# EAGLE schematic Mainboard (EAGLE 8.7.1)

## Sheet 1 of 4: Avionics
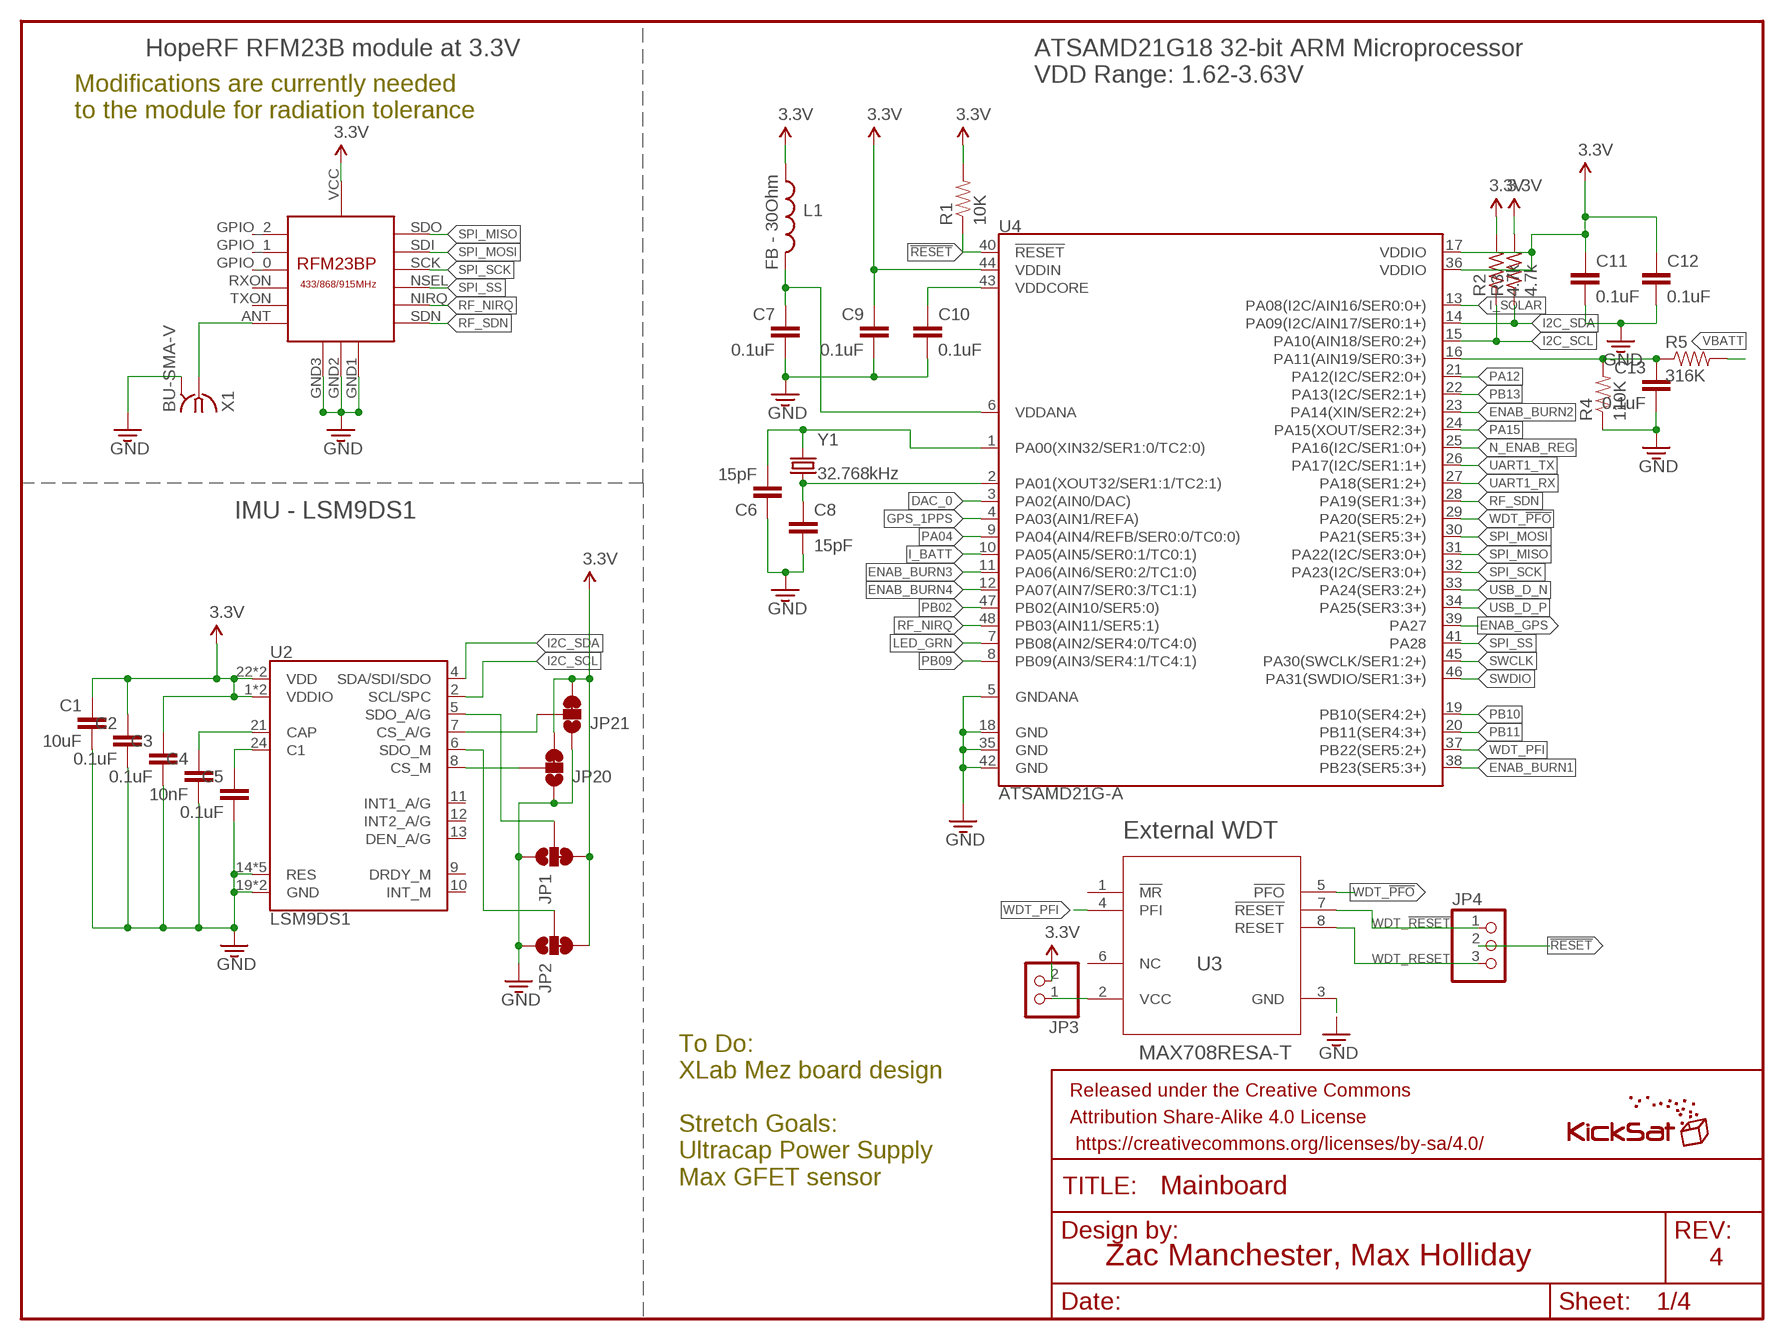
[diagram p0: schematic, sheet 1]

### Parts
C1  10uF  10UF-6.3V-20%(0603)  [0603-CAP]
C2  0.1uF  0.1UF-25V(+80/-20%)(0603)  [0603-CAP]
C3  0.1uF  0.1UF-25V(+80/-20%)(0603)  [0603-CAP]
C4  10nF  10NF/10000PF-50V-10%(0603)  [0603-CAP]
C5  0.1uF  0.1UF-25V(+80/-20%)(0603)  [0603-CAP]
C6  15pF  15PF-50V-5%(0603)  [0603-CAP@1]
C7  0.1uF  0.1UF-25V(+80/-20%)(0603)  [0603-CAP]
C8  15pF  15PF-50V-5%(0603)  [0603-CAP@1]
C9  0.1uF  0.1UF-25V(+80/-20%)(0603)  [0603-CAP]
C10  0.1uF  0.1UF-25V(+80/-20%)(0603)  [0603-CAP]
C11  0.1uF  0.1UF-25V(+80/-20%)(0603)  [0603-CAP]
C12  0.1uF  0.1UF-25V(+80/-20%)(0603)  [0603-CAP]
C13  0.1uF  0.1UF-25V(+80/-20%)(0603)  [0603-CAP]
FRAME1  FRAME-LETTER  [CREATIVE_COMMONS]
JP1  JUMPER-PAD-3-2OF3_NC_BY_TRACE_SMALL  [PAD-JUMPER-3-2OF3_NC_BY_TRACE_YES_SILK_FULL_BOX]
JP2  JUMPER-PAD-3-2OF3_NC_BY_TRACE_SMALL  [PAD-JUMPER-3-2OF3_NC_BY_TRACE_YES_SILK_FULL_BOX]
JP3  PINHD-1X2  [1X02]
JP4  PINHD-1X3  [1X03]
JP20  JUMPER-PAD-3-2OF3_NC_BY_TRACE_SMALL  [PAD-JUMPER-3-2OF3_NC_BY_TRACE_YES_SILK_FULL_BOX]
JP21  JUMPER-PAD-3-2OF3_NC_BY_TRACE_SMALL  [PAD-JUMPER-3-2OF3_NC_BY_TRACE_YES_SILK_FULL_BOX]
L1  FB - 30Ohm  INDUCTOR0603  [0603]
L2  KICKSAT_LOGO  [KICKSAT_LOGO]
R1  10K  10KOHM-1/10W-1%(0603)0603  [0603-RES]
R2  4.7k  R-US_R0603  [R0603]
R3  4.7k  R-US_R0603  [R0603]
R4  110K  10KOHM-1/10W-1%(0603)0603  [0603-RES]
R5  316K  10KOHM-1/10W-1%(0603)0603  [0603-RES]
U1  RFM23BP  [RFM23BP]
U2  LSM9DS1  [LGA24-8X4]
U3  MAX708RESA-T  [SO8]
U4  ATSAMD21G-A  [TQFP-48]
X1  BU-SMA-V  [BU-SMA-V]
Y1  32.768kHz  CRYSTAL3.2X1.5MM  [CRYSTAL-SMD-3.2X1.5MM]

### Nets
3.3V: C1.1 C2.1 C3.1 C9.1 C11.1 C12.1 JP1.3 JP2.3 JP3.2 JP20.3 JP21.3 L1.1 R1.2 R2.2 R3.2 U1.VCC U2.1(VDDIO) U2.3(VDDIO) U2.22(VDD) U2.23(VDD) U4.17(VDDIO) U4.36(VDDIO) U4.44(VDDIN) ; also sheet 2,3,4
!RESET: JP4.2 R1.1 U4.40(!RESET!) ; also sheet 3
DAC_0: U4.3(PA02(AIN0/DAC)) ; also sheet 4
ENAB_BURN1: U4.38(PB23(SER5:3+)) ; also sheet 3
ENAB_BURN2: U4.23(PA14(XIN/SER2:2+)) ; also sheet 3
ENAB_BURN3: U4.11(PA06(AIN6/SER0:2/TC1:0)) ; also sheet 3
ENAB_BURN4: U4.12(PA07(AIN7/SER0:3/TC1:1)) ; also sheet 3
ENAB_GPS: U4.39(PA27) ; also sheet 2
GND: C1.2 C2.2 C3.2 C4.2 C5.2 C6.1 C7.2 C8.2 C9.2 C10.2 C11.2 C12.2 C13.2 JP1.1 JP2.1 JP20.1 JP21.1 R4.1 U1.GND1 U1.GND2 U1.GND3 U2.14(RES) U2.15(RES) U2.16(RES) U2.17(RES) U2.18(RES) U2.19(GND) U2.20(GND) U3.3(GND) U4.5(GNDANA) U4.18(GND) U4.35(GND) U4.42(GND) X1.2 X1.3 X1.4 X1.5 ; also sheet 2,3,4
GPS_1PPS: U4.4(PA03(AIN1/REFA)) ; also sheet 4
I2C_SCL: R2.1 U2.2(SCL/SPC) U4.15(PA10(AIN18/SER0:2+)) ; also sheet 4
I2C_SDA: R3.1 U2.4(SDA/SDI/SDO) U4.14(PA09(I2C/AIN17/SER0:1+)) ; also sheet 4
I2C_SDOA/G: JP1.2 U2.5(SDO_A/G)
I_BATT: U4.10(PA05(AIN5/SER0:1/TC0:1)) ; also sheet 2
I_SOLAR: U4.13(PA08(I2C/AIN16/SER0:0+)) ; also sheet 2
LED_GRN: U4.7(PB08(AIN2/SER4:0/TC4:0)) ; also sheet 4
N$2: C4.1 U2.21(CAP)
N$6: C5.1 U2.24(C1)
N$8: JP3.1 U3.2(VCC)
N$18: C7.1 L1.2 U4.6(VDDANA)
N$19: U1.ANT X1.1
N$21: JP2.2 U2.6(SDO_M)
N$23: JP20.2 U2.8(CS_M)
N$26: JP21.2 U2.7(CS_A/G)
N$28: C6.2 U4.1(PA00(XIN32/SER1:0/TC2:0)) Y1.P$2
N$29: C8.1 U4.2(PA01(XOUT32/SER1:1/TC2:1)) Y1.P$1
N$40: C13.1 R4.2 R5.1 U4.16(PA11(AIN19/SER0:3+))
N_ENAB_REG: U4.25(PA16(I2C/SER1:0+)) ; also sheet 2
PA04: U4.9(PA04(AIN4/REFB/SER0:0/TC0:0))
PA12: U4.21(PA12(I2C/SER2:0+)) ; also sheet 4
PA15: U4.24(PA15(XOUT/SER2:3+))
PB02: U4.47(PB02(AIN10/SER5:0)) ; also sheet 4
PB09: U4.8(PB09(AIN3/SER4:1/TC4:1)) ; also sheet 4
PB10: U4.19(PB10(SER4:2+)) ; also sheet 4
PB11: U4.20(PB11(SER4:3+)) ; also sheet 4
PB13: U4.22(PA13(I2C/SER2:1+))
RF_NIRQ: U1.NIRQ U4.48(PB03(AIN11/SER5:1))
RF_SDN: U1.SDN U4.28(PA19(SER1:3+))
SPI_MISO: U1.SDO U4.31(PA22(I2C/SER3:0+)) ; also sheet 4
SPI_MOSI: U1.SDI U4.30(PA21(SER5:3+))
SPI_SCK: U1.SCK U4.32(PA23(I2C/SER3:0+)) ; also sheet 4
SPI_SS: U1.NSEL U4.41(PA28)
SWCLK: U4.45(PA30(SWCLK/SER1:2+)) ; also sheet 3
SWDIO: U4.46(PA31(SWDIO/SER1:3+)) ; also sheet 3
UART1_RX: U4.27(PA18(SER1:2+)) ; also sheet 4
UART1_TX: U4.26(PA17(I2C/SER1:1+)) ; also sheet 4
USB_D_N: U4.33(PA24(SER3:2+)) ; also sheet 3
USB_D_P: U4.34(PA25(SER3:3+)) ; also sheet 3
VBATT: R5.2 ; also sheet 2,3
VDDCORE3: C10.1 U4.43(VDDCORE)
WDT_!PFO: U3.5(!PFO) U4.29(PA20(SER5:2+))
WDT_!RESET: JP4.1 U3.7(!RESET)
WDT_PFI: U3.4(PFI) U4.37(PB22(SER5:2+))
WDT_RESET: JP4.3 U3.8(RESET)
Unconnected: U1.GPIO_0 U1.GPIO_1 U1.GPIO_2 U1.RXON U1.TXON U2.9(DRDY_M) U2.10(INT_M) U2.11(INT1_A/G) U2.12(INT2_A/G) U2.13(DEN_A/G) U3.1(!MR) U3.6(NC)

### Notes on the sheet
- HopeRF RFM23B module at 3.3V
- ATSAMD21G18 32-bit ARM Microprocessor 
  VDD Range: 1.62-3.63V
- Modifications are currently needed
  to the module for radiation tolerance
- IMU - LSM9DS1
- External WDT
- To Do:
  XLab Mez board design
  
  Stretch Goals:
  Ultracap Power Supply
  Max GFET sensor
- Zac Manchester, Max Holliday | 4

## Sheet 2 of 4: Power
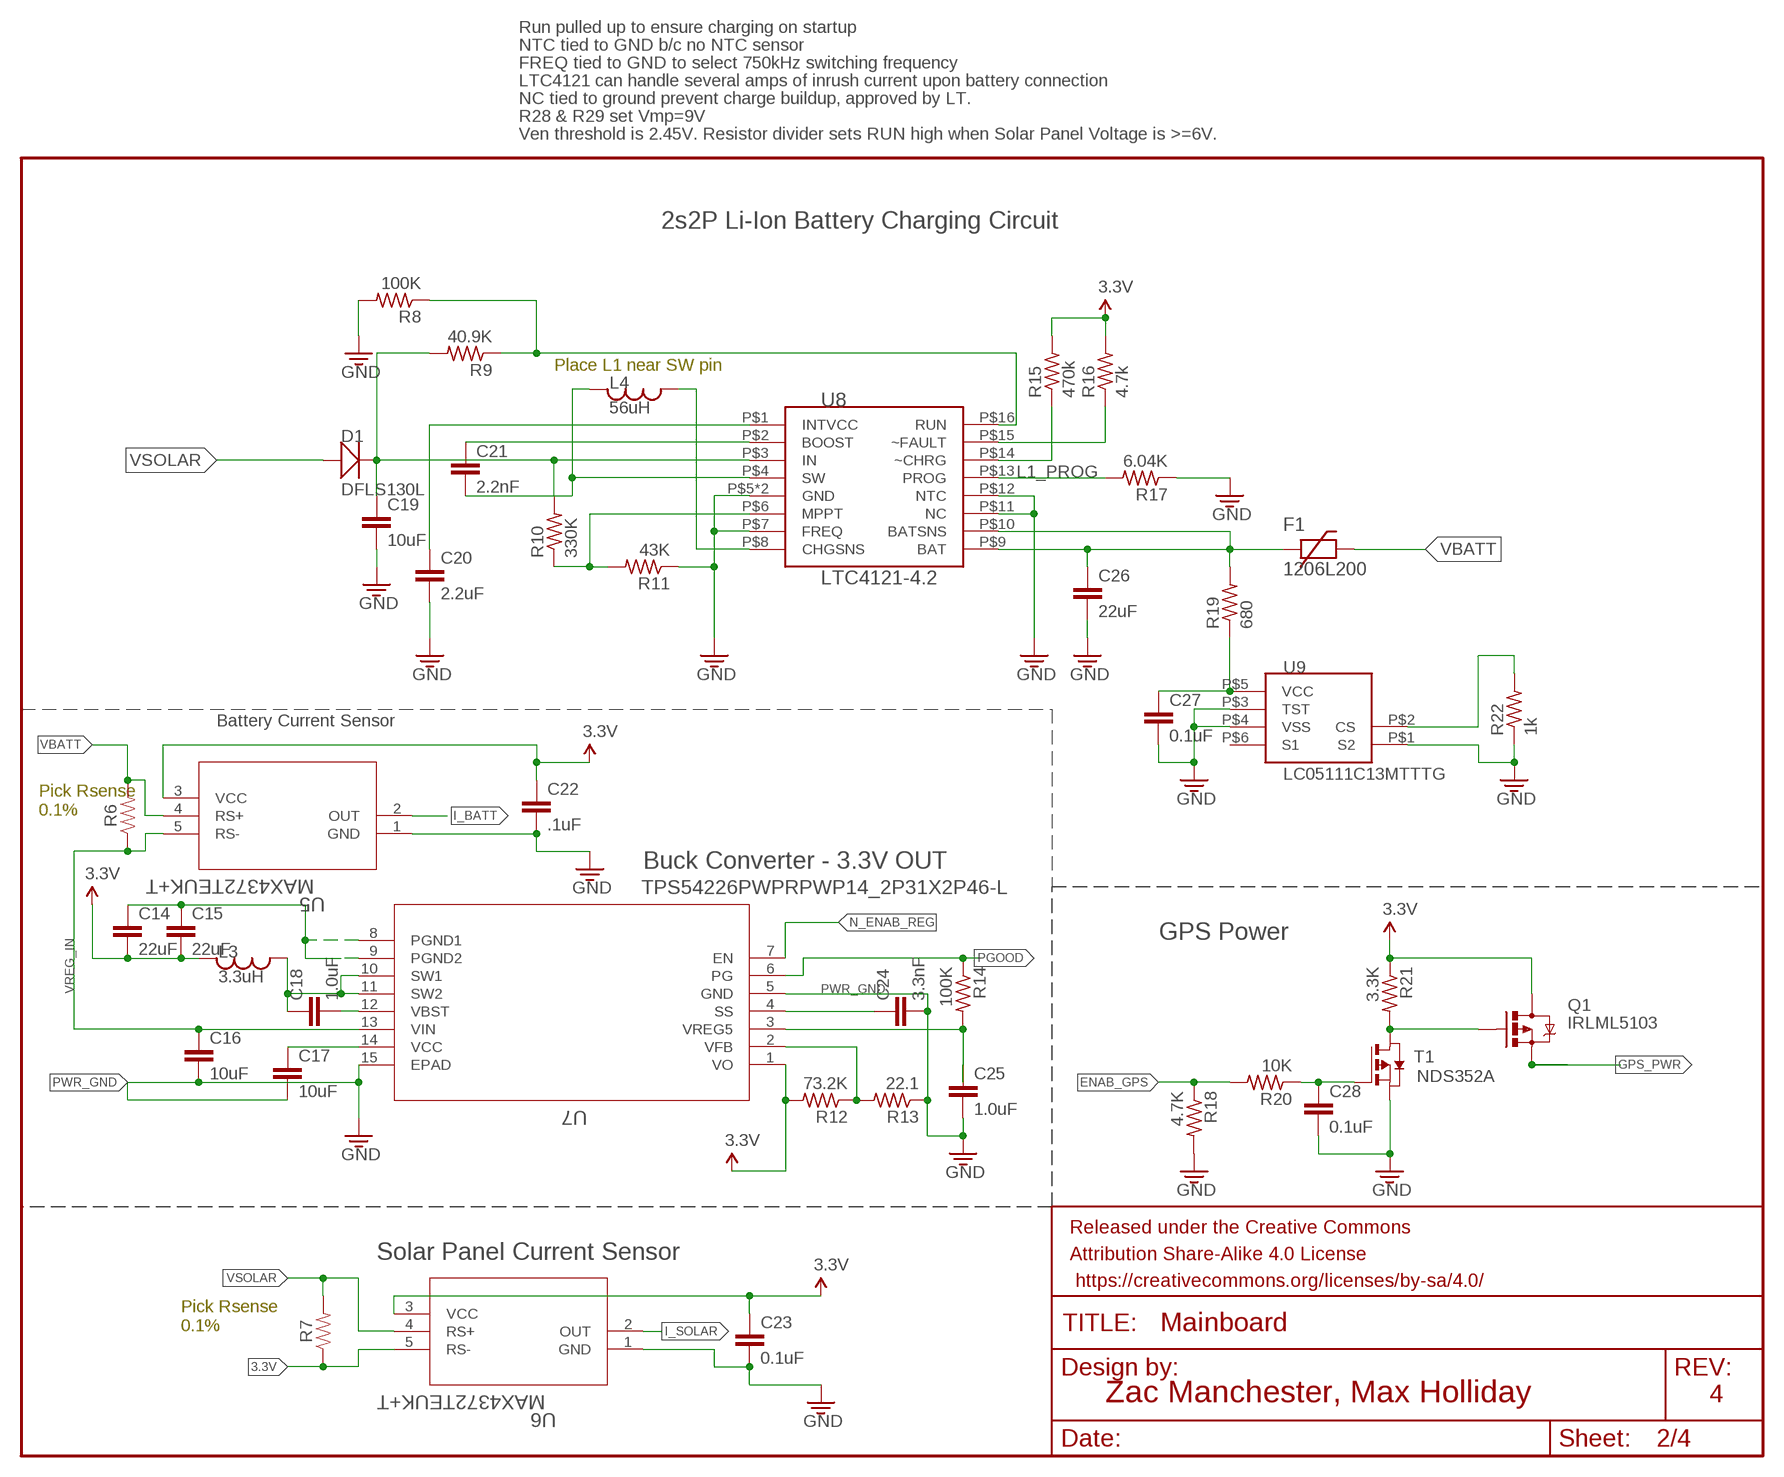
[diagram p1: schematic, sheet 2]

### Parts
C14  22uF  22UF-0805-6.3V-20%  [0805]
C15  22uF  22UF-0805-6.3V-20%  [0805]
C16  10uF  10UF-0603-6.3V-20%  [0603]
C17  10uF  10UF-0603-6.3V-20%  [0603]
C18  1.0uF  1.0UF-0603-16V-10%  [0603]
C19  10uF  10UF-0603-6.3V-20%  [0603]
C20  2.2uF  2.2UF-0603-10V-20%  [0603]
C21  2.2nF  2.2NF/2200PF-0603-50V-10%  [0603]
C22  .1uF  CAP0603-CAP  [0603-CAP@1]
C23  0.1uF  0.1UF-0603-25V-5%  [0603]
C24  3.3nF  3.3NF-0603-100V-10%  [0603]
C25  1.0uF  1.0UF-0603-16V-10%  [0603]
C26  22uF  0.1UF-0603-25V-5%  [0603]
C27  0.1uF  0.1UF-0603-25V-5%  [0603]
C28  0.1uF  0.1UF-0603-25V-5%  [0603]
D1  DFLS130L  [PWRDI-123]
F1  1206L200  PTCFUSE1206  [1206]
FRAME2  FRAME-LETTER  [CREATIVE_COMMONS]
L3  3.3uH  IND1812  [1812]
L4  56uH  IND1812  [1812]
Q1  IRLML5103  MOSFET-PCHANNEL  [SOT23-3]
R6  RESISTOR0603  [0603]
R7  RESISTOR0603  [0603]
R8  100K  R-US_R0603  [R0603]
R9  40.9K  R-US_R0603  [R0603]
R10  330K  R-US_R0603  [R0603]
R11  43K  R-US_R0603  [R0603]
R12  73.2K  R-US_R0603  [R0603]
R13  22.1  R-US_R0603  [R0603]
R14  100K  R-US_R0603  [R0603]
R15  470k  R-US_R0603  [R0603]
R16  4.7k  R-US_R0603  [R0603]
R17  6.04K  R-US_R0603  [R0603]
R18  4.7K  R-US_R0603  [R0603]
R19  680  R-US_R0603  [R0603]
R20  10K  R-US_R0603  [R0603]
R21  3.3K  R-US_R0603  [R0603]
R22  1k  R-US_R0603  [R0603]
T1  NDS352A  PMOSSOT23  [SOT-23]
U5  MAX4372TEUK+T  [21-0057F]
U6  MAX4372TEUK+T  [21-0057F]
U7  TPS54226PWPRPWP14_2P31X2P46-L  [PWP14_2P31X2P46-L]
U8  LTC4121-4.2  [QFN-16-PAD]
U9  LC05111C13MTTTG  [WDFN6]

### Nets
3.3V: C14.2 C15.2 C22.1 C23.1 L3.P$1 Q1.3(D) R7.1 R12.2 R15.2 R16.2 R21.1 U5.3(VCC) U6.3(VCC) U6.5(RS-) U7.1(VO) ; also sheet 1,3,4
ENAB_GPS: R18.1 R20.2 ; also sheet 1
GND: C19.2 C20.2 C22.2 C23.2 C26.2 C27.2 C28.2 R8.2 R11.1 R17.1 R18.2 R22.1 T1.2(S) U5.1(GND) U6.1(GND) U8.P$5(GND) U8.P$7(FREQ) U8.P$11(NC) U8.P$12(NTC) U8.P$17(GND) U9.P$1(S2) U9.P$3(TST) U9.P$4(VSS) ; also sheet 1,3,4
GPS_PWR: Q1.2(S) ; also sheet 4
I_BATT: U5.2(OUT) ; also sheet 1
I_SOLAR: U6.2(OUT) ; also sheet 1
L1_CHG: R8.1 R9.1 U8.P$16(RUN)
L1_FAULTN: R16.1 U8.P$15(~FAULT)
L1_PROG: R17.2 U8.P$13(PROG)
LION1: C26.1 F1.1 R19.2 U8.P$9(BAT) U8.P$10(BATSNS)
N$3: C18.1 L3.P$2 U7.10(SW1) U7.11(SW2)
N$10: C28.1 R20.1 T1.3(G)
N$12: Q1.1(G) R21.2 T1.1(D)
N$14: C18.2 U7.12(VBST)
N$32: C21.2 L4.P$1 U8.P$4(SW)
N$33: C21.1 U8.P$2(BOOST)
N$34: C20.1 U8.P$1(INTVCC)
N$35: R10.1 R11.2 U8.P$6(MPPT)
N$36: L4.P$2 U8.P$8(CHGSNS)
N$37: R15.1 U8.P$14(~CHRG)
N$41: C27.1 R19.1 U9.P$5(VCC)
N$42: C17.1 U7.14(VCC)
N$45: R22.2 U9.P$2(CS)
N$46: C25.1 R14.2 U7.3(VREG5)
N$51: C24.1 U7.4(SS)
N$52: R12.1 R13.2 U7.2(VFB)
N_ENAB_REG: U7.7(EN) ; also sheet 1
PGOOD: R14.1 U7.6(PG)
PWR_GND: C14.1 C15.1 C16.2 C17.2 C24.2 C25.2 R13.1 U7.5(GND) U7.8(PGND1) U7.9(PGND2) U7.15(EPAD) ; supply symbol labelled GND
VBATT: F1.2 R6.2 U5.4(RS+) ; also sheet 1,3
VREG_IN: C16.1 R6.1 U5.5(RS-) U7.13(VIN)
VSOLAR: D1.A R7.2 U6.4(RS+) ; also sheet 3
VSOLAR_IN: C19.1 D1.C R9.2 R10.2 U8.P$3(IN)
Unconnected: U9.P$6(S1)

### Notes on the sheet
- Run pulled up to ensure charging on startup
- NTC tied to GND b/c no NTC sensor
- FREQ tied to GND to select 750kHz switching frequency
- LTC4121 can handle several amps of inrush current upon battery connection
- NC tied to ground prevent charge buildup, approved by LT.
- R28 & R29 set Vmp=9V
- Ven threshold is 2.45V. Resistor divider sets RUN high when Solar Panel Voltage is >=6V.
- 2s2P Li-Ion Battery Charging Circuit
- Place L1 near SW pin
- Battery Current Sensor
- Pick Rsense
  0.1%
- Buck Converter - 3.3V OUT
- GPS Power
- Solar Panel Current Sensor
- Pick Rsense
  0.1%
- Zac Manchester, Max Holliday | 4

## Sheet 3 of 4: Connectors
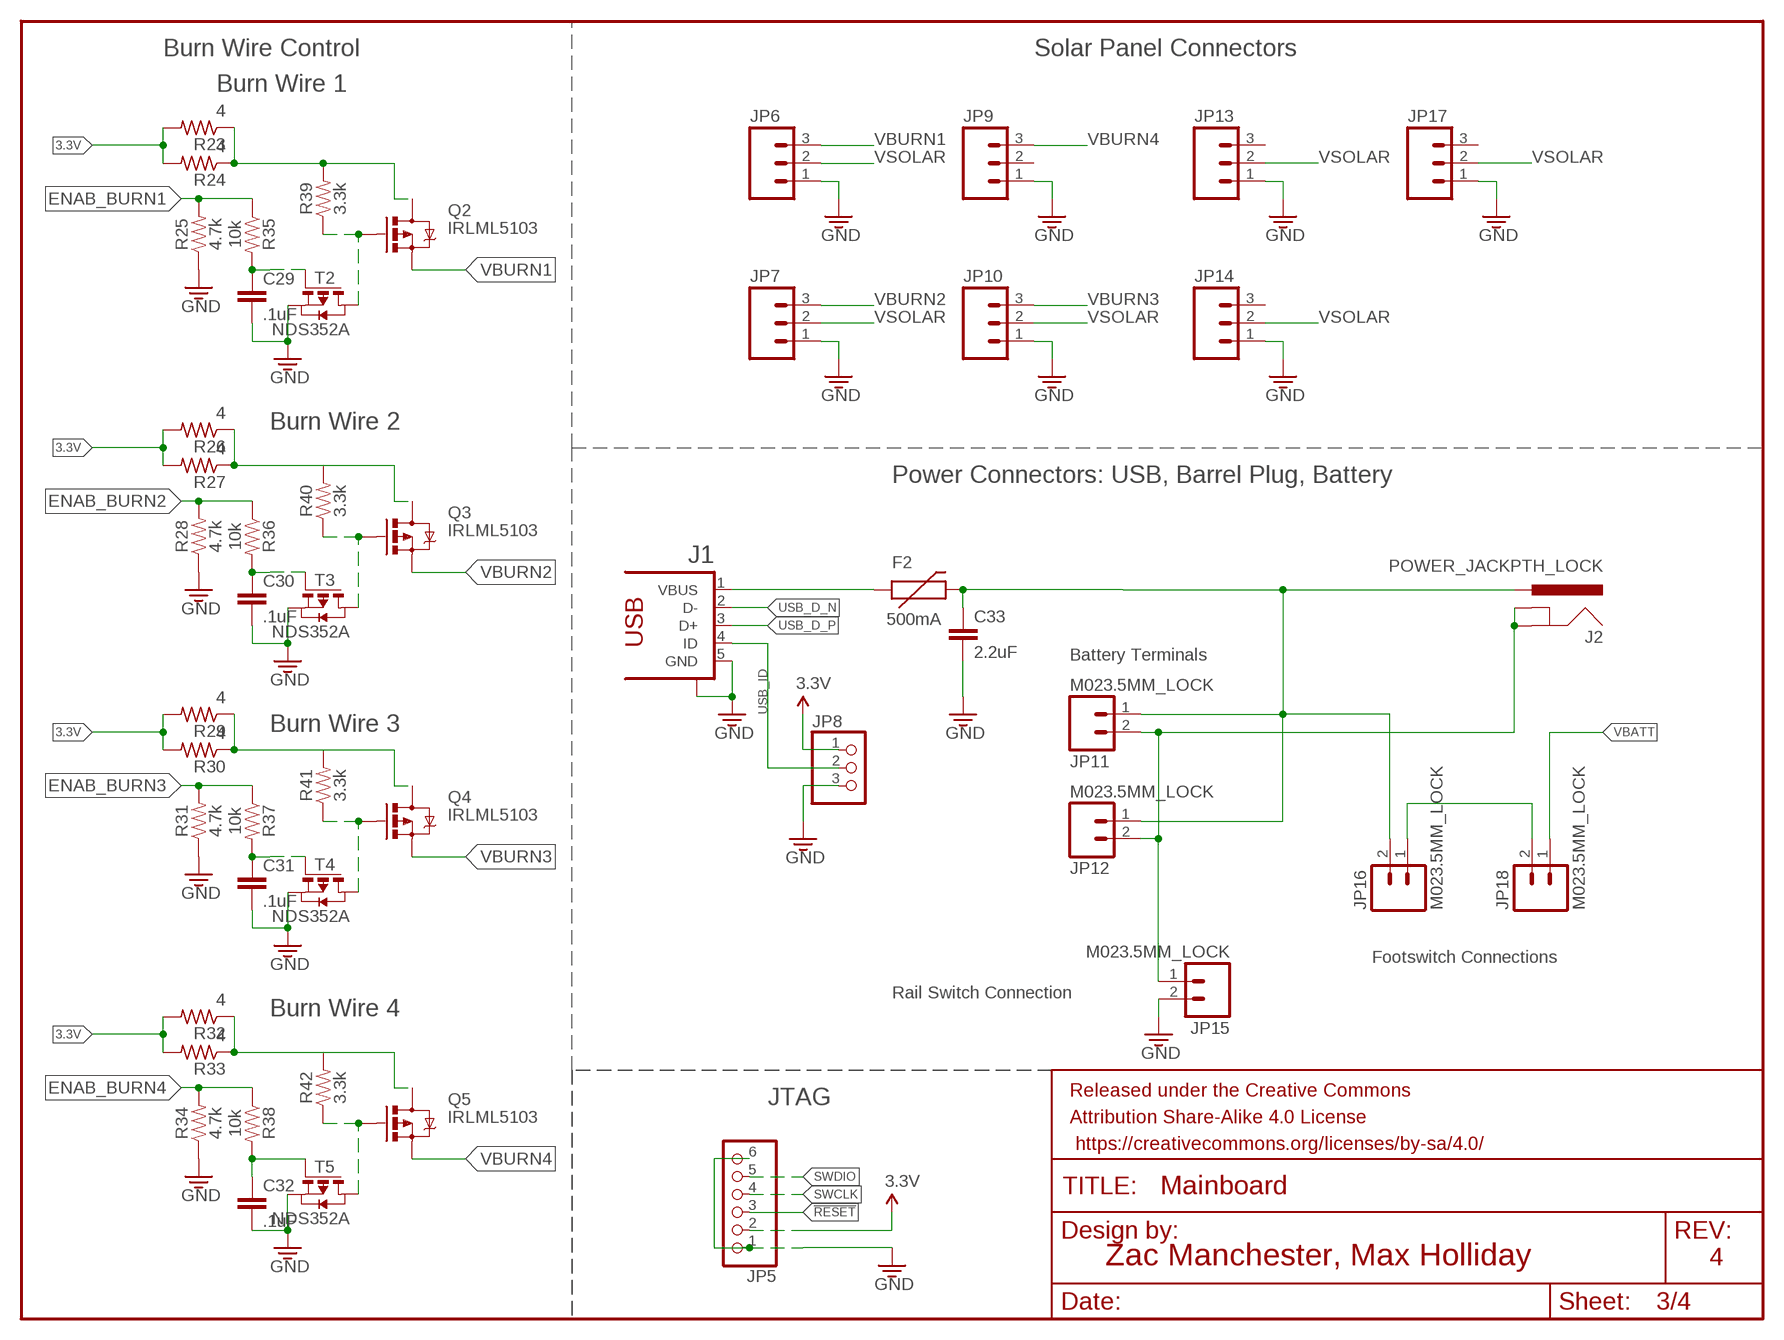
[diagram p2: schematic, sheet 3]

### Parts
C29  .1uF  CAP0603-CAP  [0603-CAP@1]
C30  .1uF  CAP0603-CAP  [0603-CAP@1]
C31  .1uF  CAP0603-CAP  [0603-CAP@1]
C32  .1uF  CAP0603-CAP  [0603-CAP@1]
C33  2.2uF  2.2UF-0603-10V-20%  [0603]
F2  500mA  PTCSMD  [PTC-1206]
FRAME3  FRAME-LETTER  [CREATIVE_COMMONS]
J1  1981584-1  [1981584-1]
J2  POWER_JACKPTH_LOCK  [POWER_JACK_PTH_LOCK]
JP5  PINHD-1X6  [1X06]
JP6  M03POLAR_LOCK  [MOLEX-1X3_LOCK]
JP7  M03POLAR_LOCK  [MOLEX-1X3_LOCK]
JP8  PINHD-1X3  [1X03]
JP9  M03POLAR_LOCK  [MOLEX-1X3_LOCK]
JP10  M03POLAR_LOCK  [MOLEX-1X3_LOCK]
JP11  M023.5MM_LOCK  [SCREWTERMINAL-3.5MM-2_LOCK]
JP12  M023.5MM_LOCK  [SCREWTERMINAL-3.5MM-2_LOCK]
JP13  M03POLAR_LOCK  [MOLEX-1X3_LOCK]
JP14  M03POLAR_LOCK  [MOLEX-1X3_LOCK]
JP15  M023.5MM_LOCK  [SCREWTERMINAL-3.5MM-2_LOCK]
JP16  M023.5MM_LOCK  [SCREWTERMINAL-3.5MM-2_LOCK]
JP17  M03POLAR_LOCK  [MOLEX-1X3_LOCK]
JP18  M023.5MM_LOCK  [SCREWTERMINAL-3.5MM-2_LOCK]
Q2  IRLML5103  MOSFET-PCHANNEL  [SOT23-3]
Q3  IRLML5103  MOSFET-PCHANNEL  [SOT23-3]
Q4  IRLML5103  MOSFET-PCHANNEL  [SOT23-3]
Q5  IRLML5103  MOSFET-PCHANNEL  [SOT23-3]
R23  4  R-US_R0603  [R0603]
R24  4  R-US_R0603  [R0603]
R25  4.7k  RESISTOR0603  [0603]
R26  4  R-US_R0603  [R0603]
R27  4  R-US_R0603  [R0603]
R28  4.7k  RESISTOR0603  [0603]
R29  4  R-US_R0603  [R0603]
R30  4  R-US_R0603  [R0603]
R31  4.7k  RESISTOR0603  [0603]
R32  4  R-US_R0603  [R0603]
R33  4  R-US_R0603  [R0603]
R34  4.7k  RESISTOR0603  [0603]
R35  10k  RESISTOR0603  [0603]
R36  10k  RESISTOR0603  [0603]
R37  10k  RESISTOR0603  [0603]
R38  10k  RESISTOR0603  [0603]
R39  3.3k  RESISTOR0603  [0603]
R40  3.3k  RESISTOR0603  [0603]
R41  3.3k  RESISTOR0603  [0603]
R42  3.3k  RESISTOR0603  [0603]
T2  NDS352A  PMOSSOT23  [SOT-23]
T3  NDS352A  PMOSSOT23  [SOT-23]
T4  NDS352A  PMOSSOT23  [SOT-23]
T5  NDS352A  PMOSSOT23  [SOT-23]

### Nets
3.3V: JP5.2 JP8.1 R23.2 R24.2 R26.2 R27.2 R29.2 R30.2 R32.2 R33.2 ; also sheet 1,2,4
!RESET: JP5.3 ; also sheet 1
ENAB_BURN1: R25.2 R35.1 ; also sheet 1
ENAB_BURN2: R28.2 R36.1 ; also sheet 1
ENAB_BURN3: R31.2 R37.1 ; also sheet 1
ENAB_BURN4: R34.2 R38.1 ; also sheet 1
GND: C29.2 C30.2 C31.2 C32.2 C33.2 J1.5(GND) J1.S1 JP5.1 JP5.6 JP6.1 JP7.1 JP8.3 JP9.1 JP10.1 JP13.1 JP14.1 JP15.2 JP17.1 R25.1 R28.1 R31.1 R34.1 T2.2(S) T3.2(S) T4.2(S) T5.2(S) ; also sheet 1,2,4
N$4: JP16.1 JP18.2
N$5: C30.1 R36.2 T3.3(G)
N$7: Q2.1(G) R39.1 T2.1(D)
N$11: C31.1 R37.2 T4.3(G)
N$13: F2.1 J1.1(VBUS)
N$15: Q3.1(G) R40.1 T3.1(D)
N$22: J2.GND J2.GNDBREAK JP11.2 JP12.2 JP15.1
N$25: C29.1 R35.2 T2.3(G)
N$38: C32.1 R38.2 T5.3(G)
N$44: Q4.1(G) R41.1 T4.1(D)
N$47: Q5.1(G) R42.1 T5.1(D)
SWCLK: JP5.4 ; also sheet 1
SWDIO: JP5.5 ; also sheet 1
USB_D_N: J1.2(D-) ; also sheet 1
USB_D_P: J1.3(D+) ; also sheet 1
USB_ID: J1.4(ID) JP8.2
VBATT: C33.1 F2.2 J2.PWR JP11.1 JP12.1 JP16.2 JP18.1 ; also sheet 1,2
VBURN1: JP6.3 Q2.2(S)
VBURN2: JP7.3 Q3.2(S)
VBURN3: JP10.3 Q4.2(S)
VBURN4: JP9.3 Q5.2(S)
VBURN_IN: Q2.3(D) Q3.3(D) Q4.3(D) Q5.3(D) R23.1 R24.1 R26.1 R27.1 R29.1 R30.1 R32.1 R33.1 R39.2 R40.2 R41.2 R42.2
VSOLAR: JP6.2 JP7.2 JP10.2 JP13.2 JP14.2 JP17.2 ; also sheet 2
Unconnected: JP9.2 JP13.3 JP14.3 JP17.3

### Notes on the sheet
- Burn Wire Control | Solar Panel Connectors
- Burn Wire 1
- Burn Wire 2
- Power Connectors: USB, Barrel Plug, Battery
- Battery Terminals
- Burn Wire 3
- Footswitch Connections
- Rail Switch Connection
- Burn Wire 4
- JTAG
- Zac Manchester, Max Holliday | 4

## Sheet 4 of 4: RF and GPS
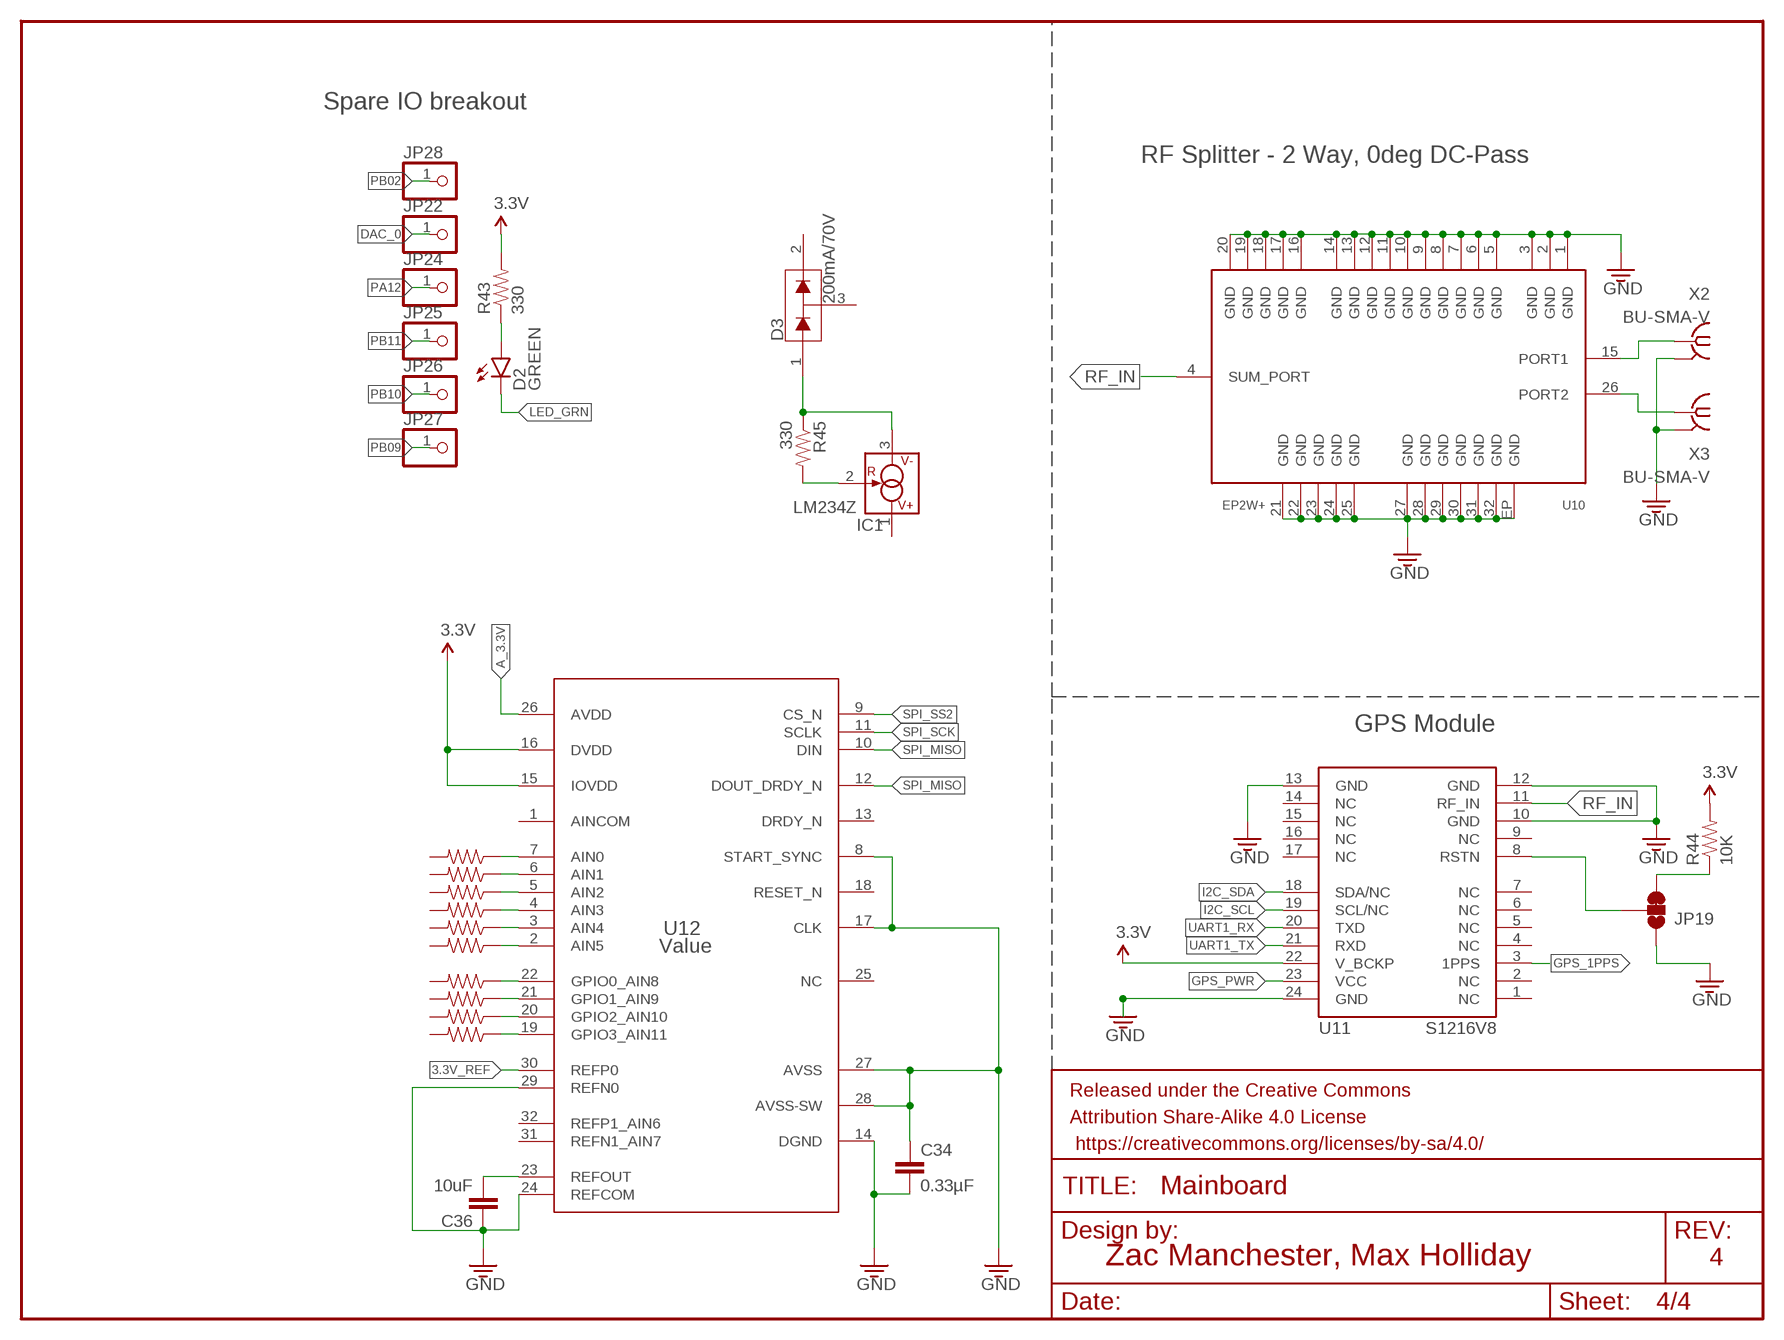
[diagram p3: schematic, sheet 4]

### Parts
C34  0.33µF  0.33UF/330NF-0805-50V-10%  [0805]
C36  10uF  10UF-0603-6.3V-20%  [0603]
D2  GREEN  LED-GREEN0603  [LED-0603]
D3  200mA/70V  BAV99  [SOT23-3]
FRAME4  FRAME-LETTER  [CREATIVE_COMMONS]
IC1  LM234Z  [TO92]
JP19  JUMPER-PAD-3-2OF3_NC_BY_TRACE_SMALL  [PAD-JUMPER-3-2OF3_NC_BY_TRACE_YES_SILK_FULL_BOX]
JP22  PINHD-1X1  [1X01]
JP24  PINHD-1X1  [1X01]
JP25  PINHD-1X1  [1X01]
JP26  PINHD-1X1  [1X01]
JP27  PINHD-1X1  [1X01]
JP28  PINHD-1X1  [1X01]
R43  330  330OHM1/10W1%(0603)  [0603-RES]
R44  10K  10KOHM-1/10W-1%(0603)0603  [0603-RES]
R45  330  330OHM1/10W1%(0603)  [0603-RES]
R46  10K  10KOHM-1/10W-1%(0603)0603  [0603-RES]
R47  10K  10KOHM-1/10W-1%(0603)0603  [0603-RES]
R48  10K  10KOHM-1/10W-1%(0603)0603  [0603-RES]
R49  10K  10KOHM-1/10W-1%(0603)0603  [0603-RES]
R50  10K  10KOHM-1/10W-1%(0603)0603  [0603-RES]
R51  10K  10KOHM-1/10W-1%(0603)0603  [0603-RES]
R52  10K  10KOHM-1/10W-1%(0603)0603  [0603-RES]
R53  10K  10KOHM-1/10W-1%(0603)0603  [0603-RES]
R54  10K  10KOHM-1/10W-1%(0603)0603  [0603-RES]
R55  10K  10KOHM-1/10W-1%(0603)0603  [0603-RES]
U10  EP2W+  [QFN32-5X5MM]
U11  S1216V8  [S1216_24PIN_PACKAGE]
U12  Value  ADS124S08IPBSR  [PBS0032A_N]
X2  BU-SMA-V  [BU-SMA-V]
X3  BU-SMA-V  [BU-SMA-V]

### Nets
3.3V: R43.2 R44.2 U11.22(V_BCKP) U12.15(IOVDD) U12.16(DVDD) ; also sheet 1,2,3
3.3V_REF: U12.30(REFP0)
A_3.3V: U12.26(AVDD)
DAC_0: JP22.1 ; also sheet 1
GND: C34.1 C34.2 C36.1 JP19.1 U10.1(GND) U10.2(GND) U10.3(GND) U10.5(GND) U10.6(GND) U10.7(GND) U10.8(GND) U10.9(GND) U10.10(GND) U10.11(GND) U10.12(GND) U10.13(GND) U10.14(GND) U10.16(GND) U10.17(GND) U10.18(GND) U10.19(GND) U10.20(GND) U10.21(GND) U10.22(GND) U10.23(GND) U10.24(GND) U10.25(GND) U10.27(GND) U10.28(GND) U10.29(GND) U10.30(GND) U10.31(GND) U10.32(GND) U10.EP(GND) U11.10(GND) U11.12(GND) U11.13(GND) U11.24(GND) U12.8(START_SYNC) U12.14(DGND) U12.17(CLK) U12.24(REFCOM) U12.27(AVSS) U12.28(AVSS-SW) U12.29(REFN0) X2.2 X2.3 X2.4 X2.5 X3.2 X3.3 X3.4 X3.5 ; also sheet 1,2,3
GPS_1PPS: U11.3(1PPS) ; also sheet 1
GPS_PWR: U11.23(VCC) ; also sheet 2
I2C_SCL: U11.19(SCL/NC) ; also sheet 1
I2C_SDA: U11.18(SDA/NC) ; also sheet 1
LED_GRN: D2.C ; also sheet 1
N$1: D2.A R43.1
N$9: JP19.2 U11.8(RSTN)
N$16: U10.15(PORT1) X2.1
N$17: U10.26(PORT2) X3.1
N$20: R47.1 U12.7(AIN0)
N$24: JP19.3 R44.1
N$27: R48.1 U12.6(AIN1)
N$30: R49.1 U12.5(AIN2)
N$31: IC1.2(R) R45.2
N$39: D3.1(A1) IC1.3(V-) R45.1
N$43: R50.1 U12.4(AIN3)
N$48: R51.1 U12.3(AIN4)
N$49: R52.1 U12.2(AIN5)
N$50: R46.1 U12.22(GPIO0_AIN8)
N$53: R53.1 U12.21(GPIO1_AIN9)
N$54: C36.2 U12.23(REFOUT)
N$55: R54.1 U12.20(GPIO2_AIN10)
N$56: R55.1 U12.19(GPIO3_AIN11)
PA12: JP24.1 ; also sheet 1
PB02: JP28.1 ; also sheet 1
PB09: JP27.1 ; also sheet 1
PB10: JP26.1 ; also sheet 1
PB11: JP25.1 ; also sheet 1
RF_IN: U10.4(SUM_PORT) U11.11(RF_IN)
SPI_MISO: U12.10(DIN) U12.12(DOUT_DRDY_N) ; also sheet 1
SPI_SCK: U12.11(SCLK) ; also sheet 1
SPI_SS2: U12.9(CS_N)
UART1_RX: U11.20(TXD) ; also sheet 1
UART1_TX: U11.21(RXD) ; also sheet 1
Unconnected: D3.2(C2) D3.3(COM) IC1.1(V+) R46.2 R47.2 R48.2 R49.2 R50.2 R51.2 R52.2 R53.2 R54.2 R55.2 U11.1(NC) U11.2(NC) U11.4(NC) U11.5(NC) U11.6(NC) U11.7(NC) U11.9(NC) U11.14(NC) U11.15(NC) U11.16(NC) U11.17(NC) U12.1(AINCOM) U12.13(DRDY_N) U12.18(RESET_N) U12.25(NC) U12.31(REFN1_AIN7) U12.32(REFP1_AIN6)

### Notes on the sheet
- Spare IO breakout
- RF Splitter - 2 Way, 0deg DC-Pass
- GPS Module
- Zac Manchester, Max Holliday | 4

## Library data of the parts
C1 = SparkFun-Capacitors:10UF-6.3V-20%(0603): CAP-11015; PROD_ID: CAP-11015
C2 C3 C5 C7 C9-C13 = SparkFun-Capacitors:0.1UF-25V(+80/-20%)(0603): CAP-00810 Ceramic Standard decoupling cap; PROD_ID: CAP-00810
C4 = SparkFun-Capacitors:10NF/10000PF-50V-10%(0603): CAP-00867; PROD_ID: CAP-00867
C6 C8 = SparkFun-Capacitors:15PF-50V-5%(0603): CAP-07881; PROD_ID: CAP-07881
C14 C15 = SparkFun-Capacitors:22UF: 22µF ceramic capacitors A capacitor is a passive two-terminal electrical component used to store electrical energy temporarily in an electric field.; PROD_ID: CAP-08402
C16 C17 C19 C36 = SparkFun-Capacitors:10UF: 10.0µF ceramic capacitors A capacitor is a passive two-terminal electrical component used to store electrical energy temporarily in an electric field.; PROD_ID: CAP-11015
C18 C25 = SparkFun-Capacitors:1.0UF: 1µF ceramic capacitors A capacitor is a passive two-terminal electrical component used to store electrical energy temporarily in an electric field.; PROD_ID: CAP-00868
C20 C33 = SparkFun-Capacitors:2.2UF: 2.2µF ceramic capacitors A capacitor is a passive two-terminal electrical component used to store electrical energy temporarily in an electric field.; PROD_ID: CAP-07888
C21 = SparkFun-Capacitors:2.2NF/2200PF: 2.2nF/2,200pF ceramic capacitors A capacitor is a passive two-terminal electrical component used to store electrical energy temporarily in an electric field.; PROD_ID: CAP-07877
C22 C29-C32 = SparkFun-Capacitors:CAP: Capacitor Standard 0603 ceramic capacitor, and 0.1" leaded capacitor.
C23 C27 C28 = SparkFun-Capacitors:0.1UF: 0.1µF ceramic capacitors A capacitor is a passive two-terminal electrical component used to store electrical energy temporarily in an electric field.; PROD_ID: CAP-08604
C24 = SparkFun-Capacitors:3.3NF: 3.3nF ceramic capacitors A capacitor is a passive two-terminal electrical component used to store electrical energy temporarily in an electric field.; PROD_ID: CAP-09633
C26 = SparkFun-Capacitors:0.1UF: 0.1µF ceramic capacitors A capacitor is a passive two-terminal electrical component used to store electrical energy temporarily in an electric field.; PROD_ID: CAP-08604; VALUE: 0.1uF
C34 = SparkFun-Capacitors:0.33UF/330NF: 0.33µF/330nF ceramic capacitors A capacitor is a passive two-terminal electrical component used to store electrical energy temporarily in an electric field.; PROD_ID: CAP-08469
D1 = BrownSpaceEngineering:DFLS130L
D2 = SparkFun-LED:LED-GREEN: Various green LEDs Green LEDs used in SFE Production 0603- DIO-00821 LARGE- DIO-00862 LILYPAD- DIO-09910; PROD_ID: DIO-00821
D3 = SparkFun-DiscreteSemi:BAV99: Series-pair diode array Two small signal silicon diodes connected anode to cathode. Connections to all three nodes available. Link to datasheet <https://www.fairchildsemi.com/datasheets/BA/BAV99.pdf> SparkFun Products: SparkFun AutoDriver <https://www.sparkfun.com/products/13752>; PROD_ID: DIO-10647
F1 = BrownSpaceEngineering:PTCFUSE: PTC Fuse
F2 = SparkFun-PowerIC:PTC: Resettable Fuse PTC Resettable Fuse. Spark Fun Electronics SKU : COM-08357; PROD_ID: RES-11150
FRAME1 FRAME2 FRAME4 = SparkFun-Aesthetics:FRAME-LETTER: Schematic Frame - Letter Standard 8.5x11 US Letter frame
FRAME3 = SparkFun-Aesthetics:FRAME-LETTER: Schematic Frame Standard 8.5x11 US Letter frame
IC1 = linear:LM*34: 3-Terminal Adjustable Current Sources Source: www.national.com/pf/LM/LM334.html | LM134.pdf
J1 = audio amplifier example:1981584-1: Receptacle, micro-USB, type A/B Tyco Electronics
J2 = SparkFun-Connectors:POWER_JACK: Power Jack Connector This is the standard 5.5mm barrel jack for power. The PTH is the most common, proven, reliable, footprint. The Slot footprint only works if the mill layer is transmitted to the PCB fab house so be warned. Here are the connectors we sell at SparkFun: DC Barrel Power Jack/Connector <https://www.sparkfun.com/products/119> (PRT-00119) DC Barrel Power Jack/Connector (SMD) <https://www.sparkfun.com/products/12748> (PRT-12748) DC Barrel Jack Adapter - Breadboard Compatible <https://www.sparkfun.com/products/10811> (PRT-10811) It is used on this SparkFun product (and many, many others): SparkFun RedBoard - Programmed with Arduino <https://www.sparkfun.com/products/12757> (DEV-12757) Also, if you need a mating power supply or connector, please check these out: Wall Adapter Power Supply - 9VDC 650mA <https://www.sparkfun.com/products/298> (TOL-00298) DC Barrel Jack Adapter - Male <https://www.sparkfun.com/products/10287> (PRT-10287); PROD_ID: CONN-08197; SF_ID: PRT-00119
JP1 JP2 JP19-JP21 = SparkFun-Passives:JUMPER-PAD-3-2OF3_NC_BY_TRACE
JP3 = pinhead:PINHD-1X2: PIN HEADER
JP4 JP8 = pinhead:PINHD-1X3: PIN HEADER
JP5 = pinhead:PINHD-1X6: PIN HEADER
JP6 JP7 JP9 JP10 JP13 JP14 JP17 = SparkFun-Connectors:M03: Header 3 Standard 3-pin 0.1" header. Use with straight break away headers (SKU : PRT-00116), right angle break away headers (PRT-00553), swiss pins (PRT-00743), machine pins (PRT-00117), and female headers (PRT-00115). Molex polarized connector foot print use with SKU : PRT-08232 with associated crimp pins and housings.
JP11 JP12 JP15 JP16 JP18 = SparkFun-Connectors:M02: Standard 2-pin 0.1" header. Use with - straight break away headers ( PRT-00116) - right angle break away headers (PRT-00553) - swiss pins (PRT-00743) - machine pins (PRT-00117) - female headers (PRT-00115) Molex polarized connector foot print use with: PRT-08233 with associated crimp pins and housings. 2.54_SCREWTERM for use with PRT-10571. 3.5mm Screw Terminal footprints for PRT-08084 5mm Screw Terminal footprints for use with PRT-08432; PROD_ID: CONN-08399
JP22 JP24-JP28 = pinhead:PINHD-1X1: PIN HEADER
L1 = SparkFun-Passives:INDUCTOR: Inductors Basic Inductor/Choke - 0603 and 1206. Footprints are not proven and vary greatly between part numbers. INDUCTOR POWER 3.3UH 4.0A SMD 0.197" L x 0.197" W x 0.177" H (5.00mm x 5.00mm x 4.50mm); PROD_ID: RES-07859
L2 = KickSat-Logo:KICKSAT_LOGO
L3 L4 = BrownSpaceEngineering:IND
Q1-Q5 = User-Submitted:MOSFET-PCHANNEL: Generic PMOSFET IRLML2244 - TRANS-11153 (SOT-23 -20V -4.3A) (1.Gate 2.Source 3.Drain) FQP27P06 - COM-10349 <http://www.sparkfun.com/products/10349> (TO-220 -60V -27A) (1.Gate 2.Source 3.Drain); PROD_ID: TRANS-08285
R1 R44 R46-R55 = SparkFun-Resistors:10KOHM-1/10W-1%(0603): RES-00824; PROD_ID: RES-00824
R2 R3 R8-R24 R26 R27 R29 R30 R32 R33 = resistor:R-US_: RESISTOR, American symbol
R4 R5 = SparkFun-Resistors:10KOHM-1/10W-1%(0603): RES-00824; PROD_ID: RES-00824; VALUE: 10K
R6 R7 R25 R28 R31 R34-R42 = SparkFun-Resistors:RESISTOR: Generic Resistor Package
R43 R45 = SparkFun-Resistors:330OHM1/10W1%(0603): RES-00818; PROD_ID: RES-00818
T1-T5 = zetex:PMOSSOT23: MOS FET; OC_FARNELL: unknown; OC_NEWARK: unknown
U1 = RFM23BP:RFM23BP: HopeRF RFM23BP Library by: http://projects.weber-itam.de; SPICEPREFIX: U
U2 = SparkFun-Sensors:LSM9DS1: LSM9DS1 3D accelerometer, gyroscope & magnetometer The LSM9DS1 is a system-in-package featuring a 3D digital linear acceleration sensor, a 3D digital angular rate sensor, and a 3D digital magnetic sensor. The LSM9DS1 has a linear acceleration full scale of ±2g/±4g/±8/±16 g, a magnetic field full scale of ±4/±8/±12/±16 gauss and an angular rate of ±245/±500/±2000 dps. The LSM9DS1 includes an I2 C serial bus interface supporting standard and fast mode (100 kHz and 400 kHz) and an SPI serial standard interface. Magnetic, accelerometer and gyroscope sensing can be enabled or set in power-down mode separately for smart power management. The LSM9DS1 is available in a plastic land grid array package (LGA) and it is guaranteed to operate over an extended temperature range from -40 °C to +85 °C.; PROD_ID: IC-12536
U3 = maholli:MAX708RESA-T; MANUFACTURER_PART_NUMBER: MAX708RESAT; VENDOR: ON Semiconductor
U4 = samd21-temp:ATSAMD21G: Atmel SAMD21G SMART ARM-Based Microcontroller The Atmel ® | SMART ™ SAM D21 is a series of low-power microcontrollers using the 32-bit ARM ® Cortex ® -M0+ processor, and ranging from 32- to 64-pins with up to 256KB Flash and 32KB of SRAM. The SAM D21 devices operate at a maximum frequency of 48MHz and reach 2.46 CoreMark/MHz. They are designed for simple and intuitive migration with identical peripheral modules, hex compatible code, identical linear address map and pin compatible migration paths between all devices in the product series. All devices include intelligent and flexible peripherals, Atmel Event System for inter-peripheral signaling, and support for capacitive touch button, slider and wheel user interfaces.; PROD_ID: IC-13064
U5 U6 = maholli:MAX4372TEUK+T; MANUFACTURER_PART_NUMBER: MAX4372TEUK+T; VENDOR: Maxim Integrated Products
U7 = maholli:TPS54226PWPR; MANUFACTURER_PART_NUMBER: TPS54226PWPR; VENDOR: Texas Instruments
U8 = BrownSpaceEngineering:LTC4121-4.2
U9 = BrownSpaceEngineering:LC05111C13MTTTG
U10 = maholli:EP2W+
U11 = maholli:S1216V8
U12 = maholli:ADS124S08IPBSR; MANUFACTURER: Texas Instruments; PARTNUMBER: ADS124S08IPBSR; REFDES: RefDes; TYPE: TYPE
X1-X3 = con-coax:BU-SMA-V: FEMALE SMA CONNECTOR Radiall distributor RS 112-3794; OC_FARNELL: unknown; OC_NEWARK: unknown
Y1 = samd21-temp:CRYSTAL: Various standard crystals. Proven footprints.; PROD_ID: XTAL-13062

## Net classes
0 default: width 0.272 mm, drill 0.381 mm, clearance 0.254 mm